# Altium schematic sheet main_6.SchDoc: main
size 282 x 200 mm; Date: 9/25/2019 7:26:17 PM; SheetNumber: 7; CNAME: RJ Cunningham; GateName_1: G$1; SymbolName_1: A4L-LOC; LibraryName: frames; DeviceSetName: A4L-LOC
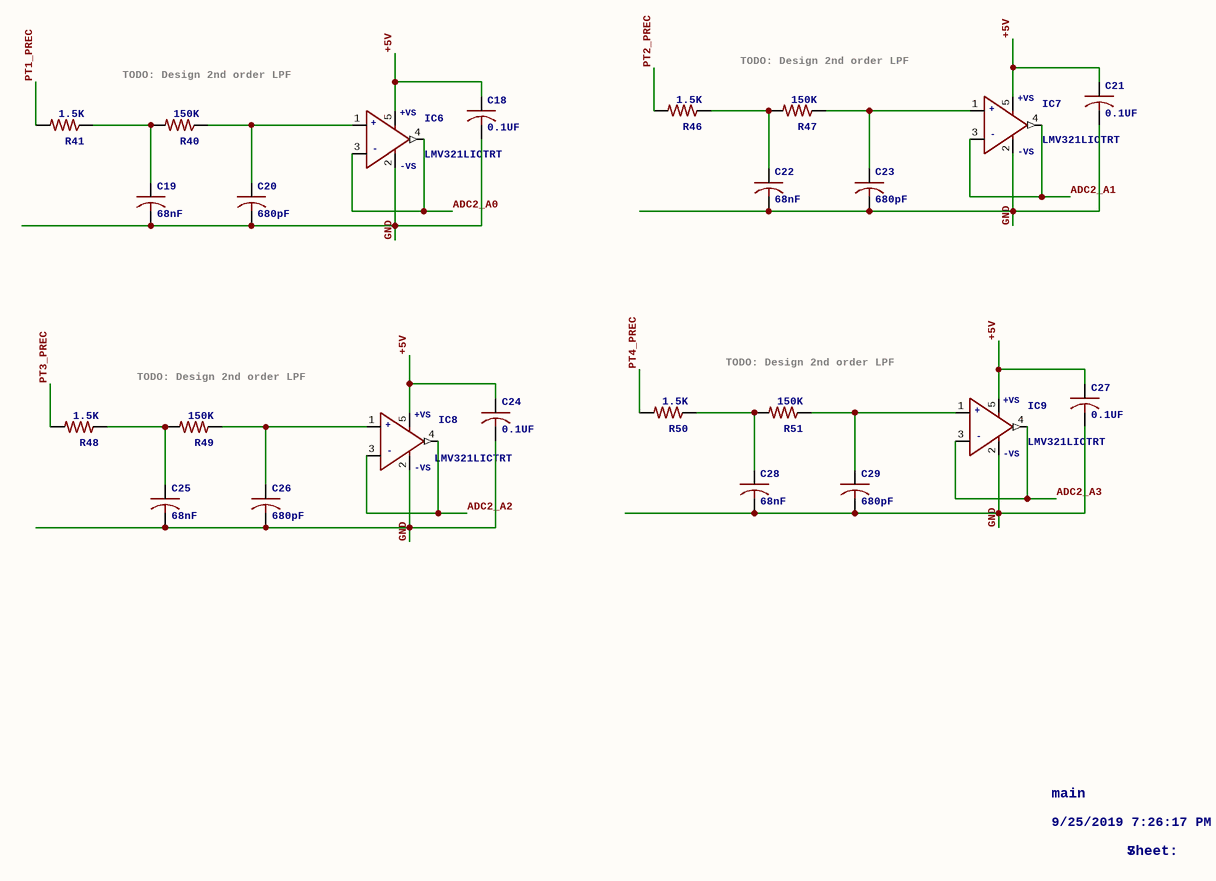
[diagram p0: main_6.SchDoc]

## Parts
C18  0.1UF  [C0805]
C19  68nF  [C0805]
C20  680pF  [C0805]
C21  0.1UF  [C0805]
C22  68nF  [C0805]
C23  680pF  [C0805]
C24  0.1UF  [C0805]
C25  68nF  [C0805]
C26  680pF  [C0805]
C27  0.1UF  [C0805]
C28  68nF  [C0805]
C29  680pF  [C0805]
IC6  LMV321LICTRT  [SOT23-5]
IC7  LMV321LICTRT  [SOT23-5]
IC8  LMV321LICTRT  [SOT23-5]
IC9  LMV321LICTRT  [SOT23-5]
R40  150K  [R0805]
R41  1.5K  [R0805]
R46  1.5K  [R0805]
R47  150K  [R0805]
R48  1.5K  [R0805]
R49  150K  [R0805]
R50  1.5K  [R0805]
R51  150K  [R0805]

## Nets
+5V: C18.1 C21.1 C24.1 C27.1 IC6.5(+VS) IC7.5(+VS) IC8.5(+VS) IC9.5(+VS)
ADC2_A0: IC6.3(IN-) IC6.4(OUT)
ADC2_A1: IC7.3(IN-) IC7.4(OUT)
ADC2_A2: IC8.3(IN-) IC8.4(OUT)
ADC2_A3: IC9.3(IN-) IC9.4(OUT)
GND: C18.2 C19.2 C20.2 C21.2 C22.2 C23.2 C24.2 C25.2 C26.2 C27.2 C28.2 C29.2 IC6.2(-VS) IC7.2(-VS) IC8.2(-VS) IC9.2(-VS)
PT1_PREC: R41.2
PT2_PREC: R46.2
PT3_PREC: R48.2
PT4_PREC: R50.2
NetC19_1: C19.1 R40.2 R41.1
NetC20_1: C20.1 IC6.1(IN+) R40.1
NetC22_1: C22.1 R46.1 R47.2
NetC23_1: C23.1 IC7.1(IN+) R47.1
NetC25_1: C25.1 R48.1 R49.2
NetC26_1: C26.1 IC8.1(IN+) R49.1
NetC28_1: C28.1 R50.1 R51.2
NetC29_1: C29.1 IC9.1(IN+) R51.1

## Notes on the sheet
- TODO: Design 2nd order LPF
- main
- 9/25/2019 7:26:17 PM
- 7
- Sheet:
- 1
- 2
- 3
- 4
- 5
- 6
- A
- B
- C
- D

## Library data of the parts
C18-C29 = C-USC0805: CAPACITOR, American symbol; GateName_1: G$1; SymbolName_1: C-US; DeviceName: C0805; LibraryName: rcl; DeviceSetName: C-US; SPICEPREFIX: C
IC6-IC9 = LMV321LICTRT: High Performance, 145 MHz FastFET Op AmpsSource: http://www.analog.com/static/imported-files/data_sheets/AD8065_8066.pdf; MPN: AD8065ARTZ-REEL7; GateName_1: G$; SymbolName_1: OP+-VS; DeviceName: RT; MF: ALTERA CORPORATION; LibraryName: st-microelectronics-extra; DeviceSetName: LMV321LICT; OC_FARNELL: 1464845; OC_NEWARK: 59K6316; +: +; -: -; +VS: +VS; -VS: -VS
R40 R41 R46-R51 = R-US_R0805: RESISTOR, American symbol; GateName_1: G$1; SymbolName_1: R-US; DeviceSetName: R-US_; DeviceName: R0805; LibraryName: rcl